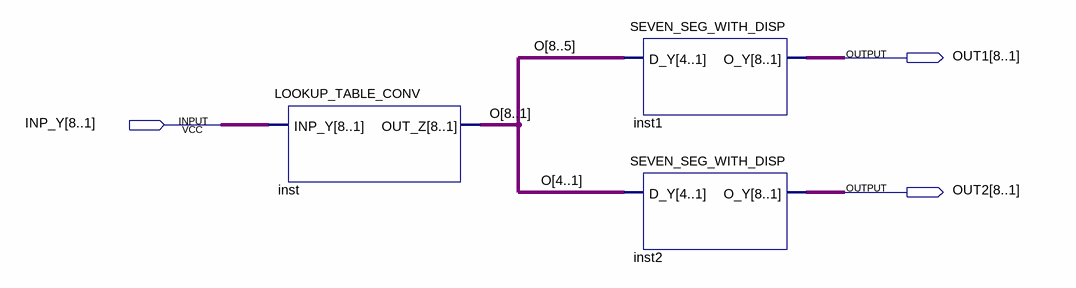
[diagram p0: schematic sheet]
// Quartus schematic Project2.bdf as structural Verilog: 3 symbols, 3 pins
module Project2 (
  input  [8:1] INP_Y,
  output [8:1] OUT1,
  output [8:1] OUT2
);

  wire [8:1] O;

  LOOKUP_TABLE_CONV inst (.INP_Y(INP_Y), .OUT_Z(O));
  SEVEN_SEG_WITH_DISP inst1 (.D_Y(O[8:5]), .O_Y(OUT1));
  SEVEN_SEG_WITH_DISP inst2 (.D_Y(O[4:1]), .O_Y(OUT2));
endmodule
